# EAGLE design Rev3 (EAGLE 7.4.0)
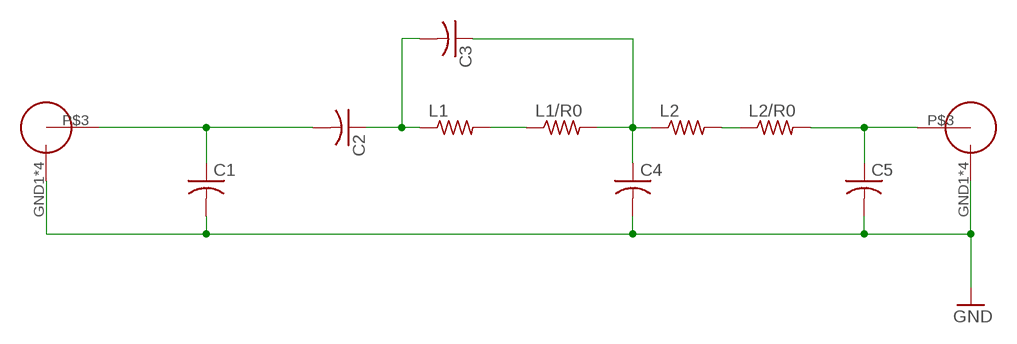
[diagram p0: schematic, sheet 1]

## Parts
C1  C-USC0603  [C0603]
C2  C-USC0603  [C0603]
C3  C-USC0603  [C0603]
C4  C-USC0603  [C0603]
C5  C-USC0603  [C0603]
L1  R-US_R0603  [R0603]
L1/R0  R-US_R0603  [R0603]
L2  R-US_R0603  [R0603]
L2/R0  R-US_R0603  [R0603]
U$1  SMAJ716-ND  [SMAJ716-ND]
U$2  SMAJ716-ND  [SMAJ716-ND]

## Nets
C3: C3.1 C4.1 L1/R0.2 L2.1
GND: C1.2 C4.2 C5.2 U$1.GND1(OUTERCONDUCTOR) U$1.GND2(OUTERCONDUCTOR) U$1.GND3(OUTERCONDUCTOR) U$1.GND4(OUTERCONDUCTOR) U$2.GND1(OUTERCONDUCTOR) U$2.GND2(OUTERCONDUCTOR) U$2.GND3(OUTERCONDUCTOR) U$2.GND4(OUTERCONDUCTOR)
N$1: C5.1 L2/R0.2 U$2.P$3(CENTERCONDUCTOR)
N$5: L2.2 L2/R0.1
N$7: C2.1 C3.2 L1.1
N$8: L1.2 L1/R0.1
N$9: C1.1 C2.2 U$1.P$3(CENTERCONDUCTOR)

## Library data of the parts
C1-C5 = adafruit:C-US: CAPACITOR, American symbol
L1 L1/R0 L2 L2/R0 = adafruit:R-US_: RESISTOR, American symbol
U$1 U$2 = SMAJ16-ND:SMAJ716-ND

## Net classes
0 default: width 1.422 mm, drill 0.508 mm, clearance 1.016 mm

## Board
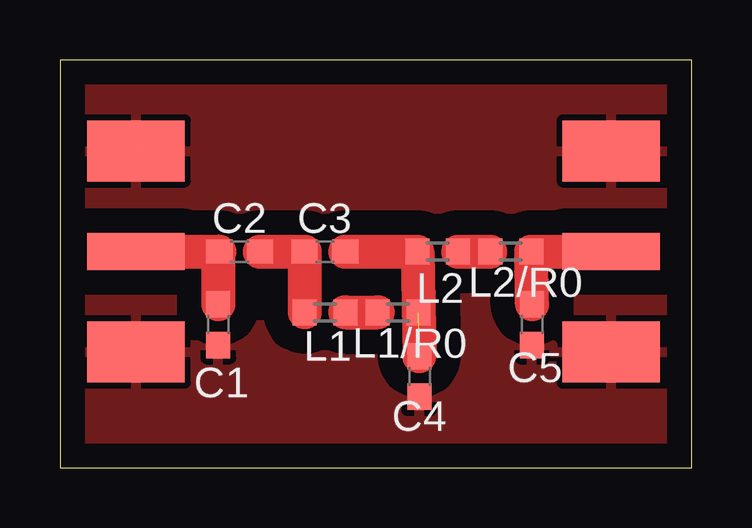
[diagram p1: board, top side]
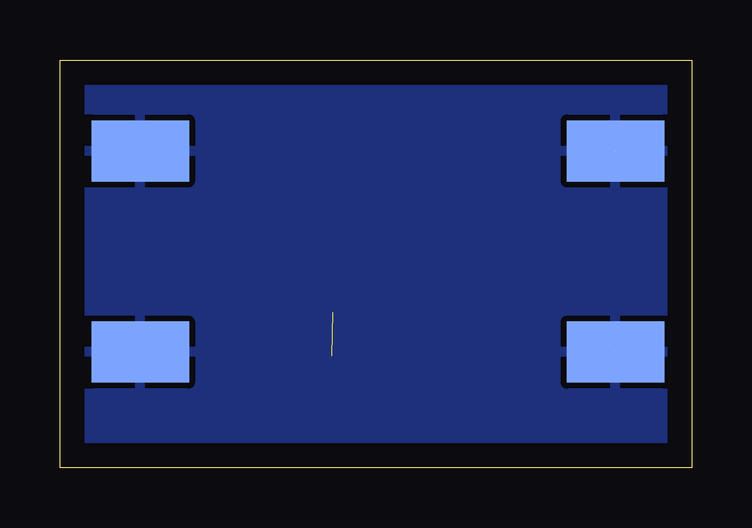
[diagram p2: board, bottom side, seen from below]

Size 26.34 x 17.01 mm. Coordinates in mm from the lower left corner, seen from the top.
Outline: 0,0 26.34,0 26.34,17.01 0,17.01 0,0
Copper layers (1*16): Top 0.035mm / dielectric 1.5mm / Bottom 0.035mm
Design rules "default": minimum track width 10mil, minimum drill 24mil, track to track 8mil, track to pad 8mil, pad to pad 8mil, via to via 8mil, smd to smd 8mil, copper to edge 40mil, drill to drill 8mil, minimum pad ring 10mil, minimum via ring 8mil, stop-mask expansion 4mil, vias tented up to drill 0mil, thermal gap 10mil

### Footprints (pad centres in the part's own frame; a part is rotated, then mirrored left to right if it is on the bottom)
C0603 = smd 1.1 x 1: 1 -0.85,0; 2 0.85,0
R0603 = smd 1 x 1.1: 1 -0.85,0; 2 0.85,0
SMAJ716-ND = smd 2.54 x 4.064 bottom: GND1 4.191,0.508; GND3 -4.191,0.508 | smd 2.54 x 4.064: GND2 -4.191,0.508; GND4 4.191,0.508 | smd 1.524 x 4.064: P$3 0,0.508

### Placement (x,y rotation side)
C1  6.6,5.97 270 top
C2  7.49,9.02 180 top
C3  11.05,9.02 180 top
C4  14.99,3.81 270 top
C5  19.69,5.97 270 top
L1  11.05,6.48 0 top
L1/R0  14.1,6.48 0 top
L2  15.75,9.02 0 top
L2/R0  18.8,9.02 0 top
U$1  3.68,9.02 90 top
U$2  22.48,9.02 270 top

### Tracks (layer width: path | path; a pad name or v marks a point on that pad's centre or on a via)
C3  (1 unrouted)
  Top 1.422: C3.1 L2.1 C4.1
GND  (2 unrouted)
  pour Top: -3.56,-0.38 30.99,-0.38 30.99,20.45 -3.56,20.45 -3.56,20.32
  pour Bottom: -1.9,17.4 29.72,17.4 29.72,-0.38 -1.9,-0.38
N$1
  Top 1.422: U$2.P$3 L2/R0.2 C5.1
N$5
  Top 1.422: L2.2 L2/R0.1
N$7
  Top 1.422: C2.1 C3.2 L1.1
N$8
  Top 1.422: L1.2 L1/R0.1
N$9
  Top 1.422: U$1.P$3 C2.2 6.6,9.02 C1.1